# EAGLE schematic ESP12_Harness (EAGLE 8.0.0)
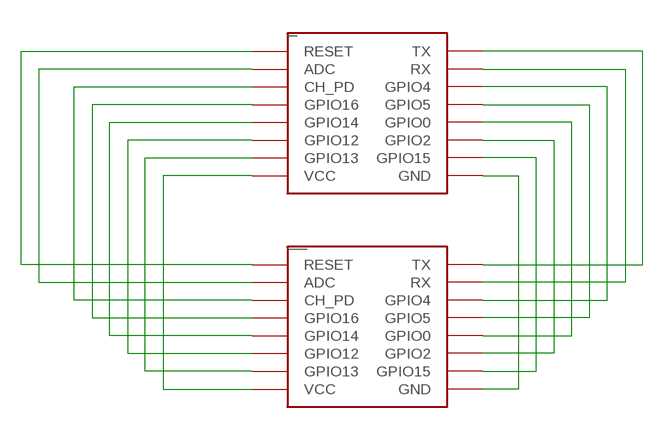
[diagram p0: schematic, sheet 1]

## Parts
_  ESP12  [ESP12]
__  ESP12  [ESP12]

## Nets
GND: _.GND __.GND
N$2: _.GPIO13 __.GPIO13
N$3: _.GPIO12 __.GPIO12
N$4: _.GPIO14 __.GPIO14
N$5: _.GPIO16 __.GPIO16
N$6: _.CH_PD __.CH_PD
N$7: _.ADC __.ADC
N$8: _.RESET __.RESET
N$10: _.GPIO15 __.GPIO15
N$11: _.GPIO2 __.GPIO2
N$12: _.GPIO0 __.GPIO0
N$13: _.GPIO5 __.GPIO5
N$14: _.GPIO4 __.GPIO4
N$15: _.RX __.RX
N$16: _.TX __.TX
VCC: _.VCC __.VCC

## Library data of the parts
_ __ = esp8266modules:ESP12: ESP8266 Wifi module 12